# Altium schematic sheet Current Sensor.SchDoc
size A4
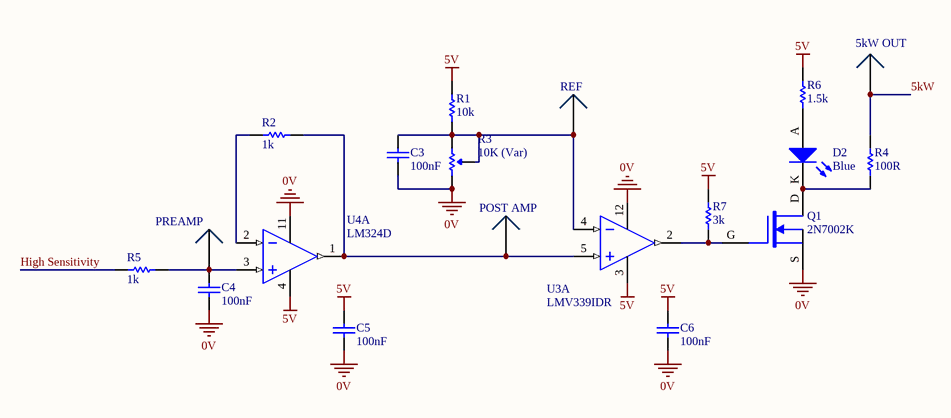
[diagram p0: Current Sensor.SchDoc]

## Parts
5kW_OUT  0mm  [TH Test Point]  (value not drawn)
C3  100nF  [0805]
C4  100nF  [0805]
C5  100nF  [0805]
C6  100nF  [0805]
D2  Blue  [0805 LED]
POST_AMP  0mm  [TH Test Point]  (value not drawn)
PREAMP  0mm  [TH Test Point]  (value not drawn)
Q1  2N7002K  [ON SOT-23 MOSFET]
R1  10k  [0805]
R2  1k  [0805]
R3  10K (Var)  [B 3296]
R4  100R  [0805]
R5  1k  [0805]
R6  1.5k  [0805]
R7  3k  [0805]
REF  0mm  [TH Test Point]  (value not drawn)
U3  LMV339IDR  [TI 14-SOIC]  (part A of 4)
U4  LM324D  [TI 14-SOIC]  (part A of 4)

## Nets
0V: C3.1 C4.1 C5.1 C6.1 Q1.S R3.3(CW) U3.12(V-) U4.11(GND)
5V: C5.2 C6.2 R1.2 R6.2 R7.2 U3.3(V+) U4.4(VCC)
5kW: 5kW_OUT.1 R4.2
High Sensitivity: R5.1
NetC3_2: C3.2 R1.1 R3.1(CCW) R3.2(Wiper) REF.1 U3.4(IN_A-)
NetC4_2: C4.2 PREAMP.1 R5.2 U4.3(1IN+)
NetD2_A: D2.A R6.1
NetD2_K: D2.K Q1.D R4.1
NetPOST_AMP_1: POST_AMP.1 R2.2 U3.5(IN_A+) U4.1(1OUT)
NetQ1_G: Q1.G R7.1 U3.2(OUT_A)
NetR2_1: R2.1 U4.2(1IN+)

## Library data of the parts
5kW_OUT POST_AMP PREAMP REF = TH Test Point: Positions: 1; Angle: 0; Flange: No; Contact: NA; Part Number: TH Test Point; Pitch: 0mm; Row Spacing: 0mm
C3-C6 = GCM21BR71E104KA37L: Manufacturer: muRata; Tolerance: 10%; Material: X7R; Rated Voltage: 25V; Part Number: GCM21BR71E104KA37L; Value: 100nF
D2 = SML-MN2BCTT86C: LED BLUE CLEAR 2012 SMD; Manufacturer: ROHM Semiconductor; Part Number: SML-MN2BCTT86C; Colour: Blue; Digikey Part Number: 846-1207-1-ND; Digikey Link: https://www.digikey.com/product-detail/en/rohm-semiconductor/SMLMN2BCTT86C/846-1207-1-ND/6057239
Q1 = 2N7002K: 60V 380mA, NFET MOSTFET (Small Signal); Manufacturer: ON Semiconductor; Published: 24-Mar-1999; LatestRevisionDate: 29-May-2009; LatestRevisionNote: IPC-7351 Footprint Added.; PackageVersion: Sep-2000; PackageReference: SOT-343; Publisher: Altium Limited; PackageDescription: 4-Pin SOT-343 Package 1.3 mm Pitch, 2.1 mm Lead Span; Part Number: 2N7002K; Digikey Part Number: 2N7002KCT-ND; Digikey Link: https://www.digikey.com/product-detail/en/on-semiconductor/2N7002K/2N7002KCT-ND/2060375; Qty: 30
R1 = RC0805FR0710KL: Manufacturer: YAGEO; Tolerance: 0.01; Rated Voltage: 0.125W; Part Number: RC0805FR0710KL; Value: 10k; Material: FR-07
R2 R5 = RC0805FR071KL: Manufacturer: YAGEO; Tolerance: 0.01; Rated Voltage: 0.125W; Part Number: RC0805FR071KL; Value: 1k; Material: FR-07
R3 = 3296W-1-103LF: Manufacturer: Bournes Inc; Tolerance: 0.1; Rated Voltage: 0.5W; Part Number: 3296W-1-103LF; Value: 10K (Var); Digikey Part Number: 3296W-103LF-ND
R4 = RC0805FR07100RL: Manufacturer: YAGEO; Tolerance: 0.01; Rated Voltage: 0.125W; Part Number: RC0805FR07100RL; Value: 100R; Material: FR-07
R6 = RC0805FR071K5L: Manufacturer: YAGEO; Tolerance: 0.01; Rated Voltage: 0.125W; Part Number: RC0805FR071K5L; Value: 1.5k; Material: FR-07
R7 = RC0805FR073KL: Manufacturer: YAGEO; Tolerance: 0.01; Rated Voltage: 0.125W; Part Number: RC0805FR073KL; Value: 3k; Material: FR-07
U3 = LMV339IDR: Comparator General Purpose Open Collector 14-SOIC; Manufacturer: Texas Instruments; Part Number: LMV339IDR; Digikey Part Number: 296-6611-2-ND; Digikey Link: https://www.digikey.com/product-detail/en/texas-instruments/LMV339MTX-NOPB/296-35446-1-ND/3739150
U4 = LM324D: IC OPAMP GP 4 CIRCUIT 14SOIC; Manufacturer: Texas Instruments; Part Number: LM324D; Digikey Part Number: 296-1390-5-ND; Digikey Link: https://www.digikey.com/product-detail/en/texas-instruments/LM324D/296-1390-5-ND/277039